# EAGLE design ESP-VINDRIKTNING_no_batt (EAGLE 9.6.2)
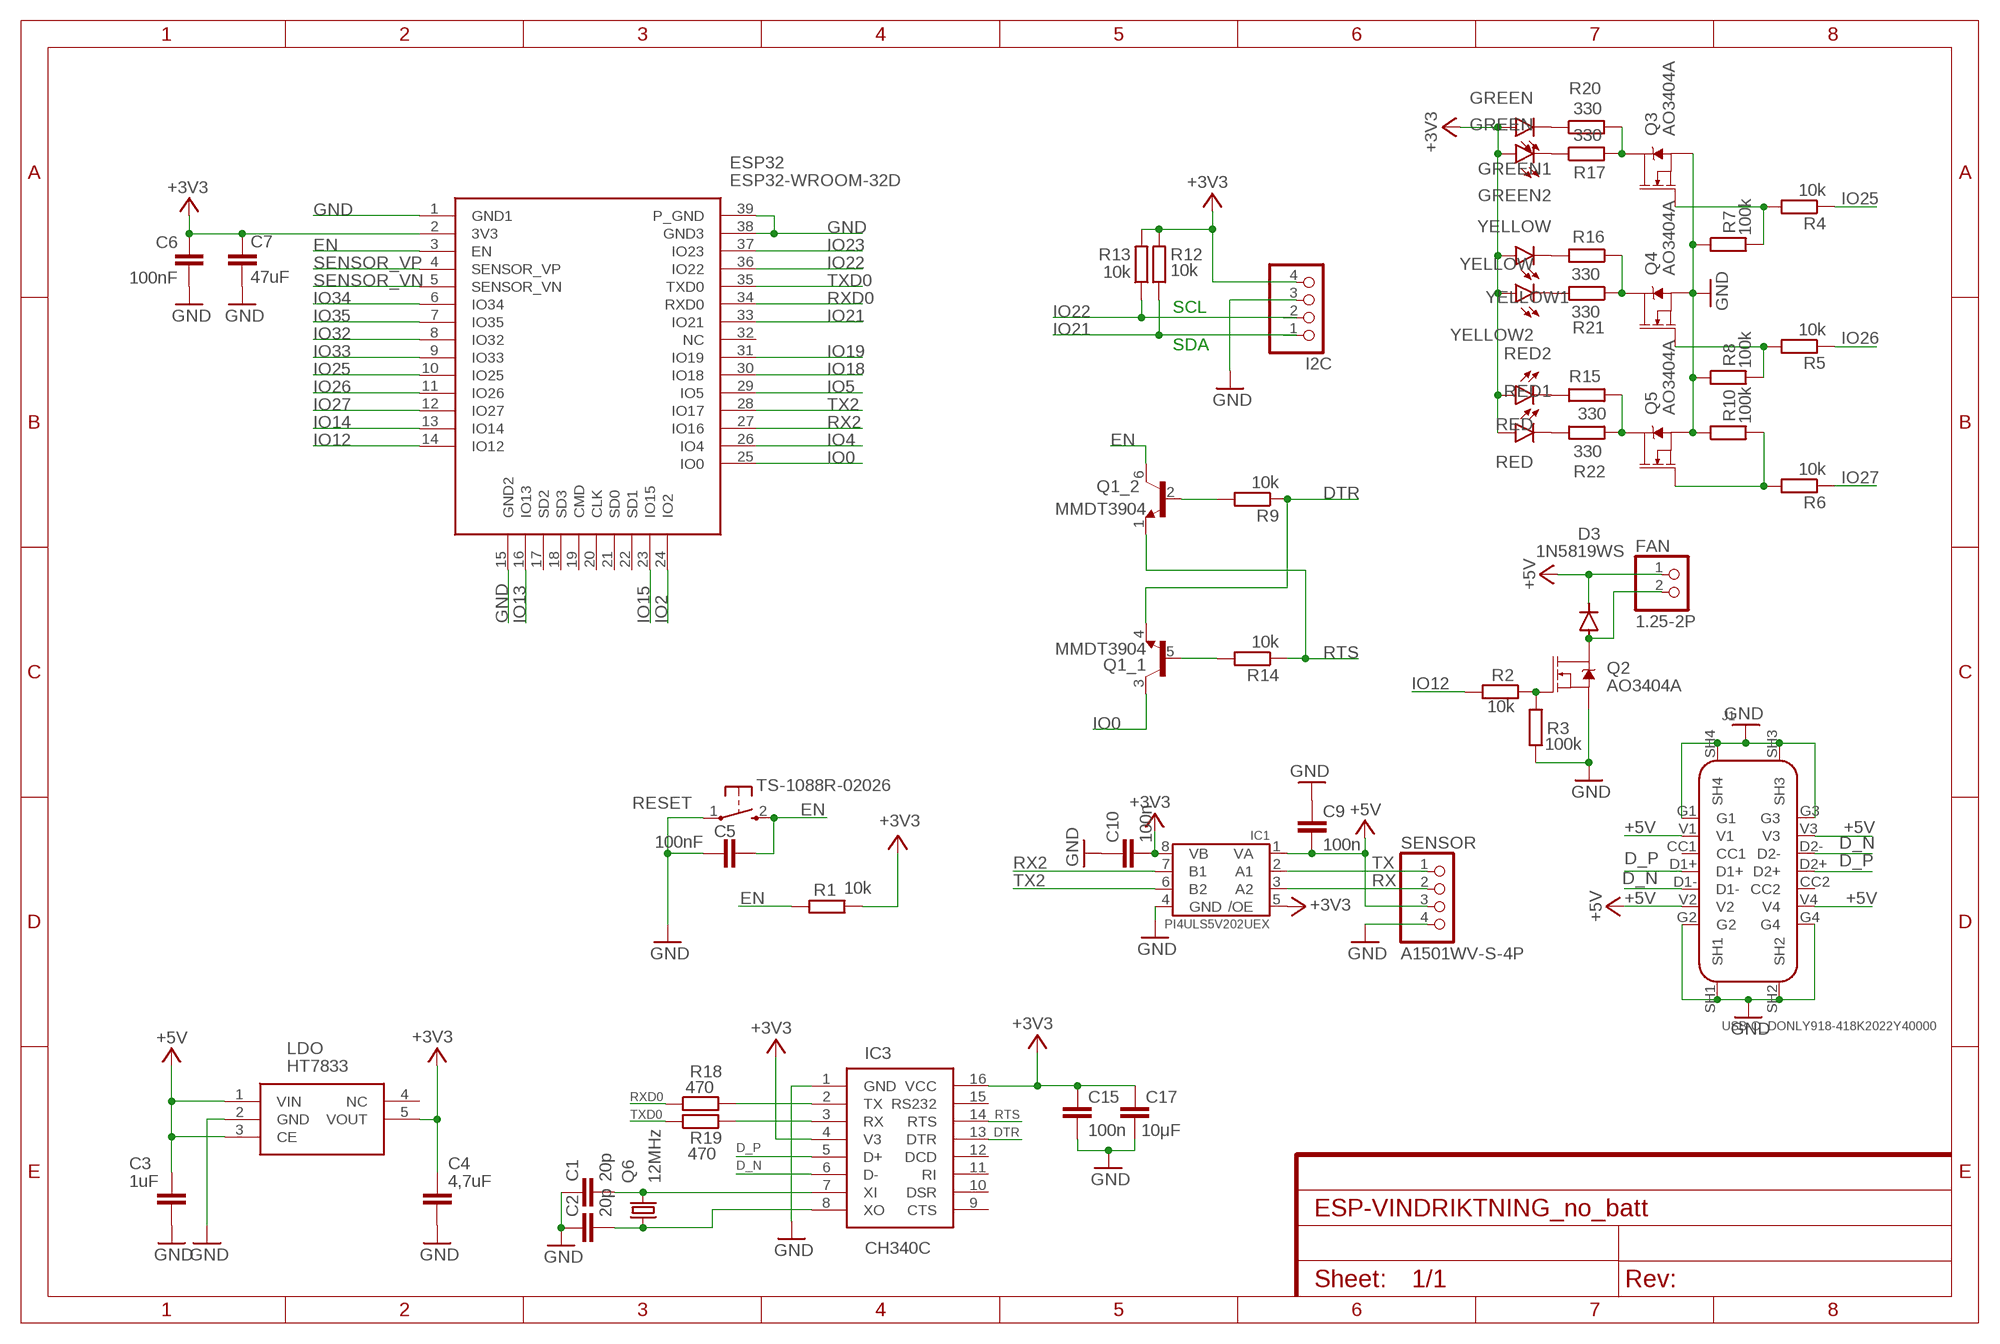
[diagram p0: schematic, sheet 1]

## Parts
C1  20p  C-EUC0402  [C0402]
C2  20p  C-EUC0402  [C0402]
C3  1uF  C-EUC0603  [C0603]
C4  4,7uF  C-EUC0603  [C0603]
C5  100nF  C-EUC0402  [C0402]
C6  100nF  C-EUC0603  [C0603]
C7  47uF  C-EUC0603  [C0603]
C9  100n  C-EUC0603  [C0603]
C10  100n  C-EUC0603  [C0603]
C15  100n  C-EUC0603  [C0603]
C17  10μF  C-EUC0603  [C0603]
D3  1N5819WS  DIODE-SOD323-R  [SOD323-R]
ESP32  ESP32-WROOM-32D  [ESP32WROOM32D]
FAN  1.25-2P  [1.25-2P]
GREEN1  GREEN  LEDCHIP-LED0603  [CHIP-LED0603]
GREEN2  GREEN  LEDCHIP-LED0603  [CHIP-LED0603]
I2C  PINHD-1X4  [1X04]
IC1  PI4ULS5V202UEX  [MSOP8]
IC3  CH340C  USB_UART_CONVERTOR_CH340G  [SOIC16]
J1  USB-C_DONLY918-418K2022Y40000  [USB-C-TH]
LDO  HT7833  HT78XX-SOT23-5SOT23-5  [SOT23-5]
Q1  MMDT3904  TRANS_NPN_DUAL-MBT3904DW1T1  [SC70-6]
Q2  AO3404A  MOSFET-NCH-AO3404A  [SOT23-3]
Q3  AO3404A  MOSFET-NCH-AO3404A  [SOT23-3]
Q4  AO3404A  MOSFET-NCH-AO3404A  [SOT23-3]
Q5  AO3404A  MOSFET-NCH-AO3404A  [SOT23-3]
Q6  12MHz  KX-7  [3.2X2.5_KX-7]
R1  10k  R-EU_R0402  [R0402]
R2  10k  R-EU_R0402  [R0402]
R3  100k  R-EU_R0402  [R0402]
R4  10k  R-EU_R0402  [R0402]
R5  10k  R-EU_R0402  [R0402]
R6  10k  R-EU_R0402  [R0402]
R7  100k  R-EU_R0402  [R0402]
R8  100k  R-EU_R0402  [R0402]
R9  10k  R-EU_R0402  [R0402]
R10  100k  R-EU_R0402  [R0402]
R12  10k  R-EU_R0603  [R0603]
R13  10k  R-EU_R0603  [R0603]
R14  10k  R-EU_R0402  [R0402]
R15  330  R-EU_R0603  [R0603]
R16  330  R-EU_R0603  [R0603]
R17  330  R-EU_R0603  [R0603]
R18  470  R-EU_R0402  [R0402]
R19  470  R-EU_R0402  [R0402]
R20  330  R-EU_R0603  [R0603]
R21  330  R-EU_R0603  [R0603]
R22  330  R-EU_R0603  [R0603]
RED1  RED  LEDCHIP-LED0603  [CHIP-LED0603]
RED2  RED  LEDCHIP-LED0603  [CHIP-LED0603]
RESET  TS-1088R-02026  MOMENTARY_SWITCH_TS-1088R-02026  [TS1088R02026]
SENSOR  A1501WV-S-4P  [A1501WV-S-4P]
YELLOW1  YELLOW  LEDCHIP-LED0603  [CHIP-LED0603]
YELLOW2  YELLOW  LEDCHIP-LED0603  [CHIP-LED0603]

## Nets
+3V3: C4.1 C6.1 C7.1 C10.2 C15.1 C17.1 ESP32.2(3V3) GREEN1.A GREEN2.A I2C.4 IC1.5(/OE) IC1.8(VB) IC3.4(V3) IC3.16(VCC) LDO.5(VOUT) R1.1 R12.2 R13.2 RED1.A RED2.A YELLOW1.A YELLOW2.A
+5V: C3.1 C9.2 D3.C FAN.1 IC1.1(VA) J1.V1 J1.V2 J1.V3 J1.V4 LDO.1(VIN) LDO.3(CE) SENSOR.3
D_N: IC3.6(D-) J1.D1- J1.D2-
D_P: IC3.5(D+) J1.D1+ J1.D2+
DTR: IC3.13(DTR) Q1.4(_1:E) R9.1
EN: C5.2 ESP32.3(EN) Q1.6(_2:C) R1.2 RESET.2
G: Q3.3(D) R17.2 R20.2
GND: C1.1 C2.1 C3.2 C4.2 C5.1 C6.2 C7.2 C9.1 C10.1 C15.2 C17.2 ESP32.1(GND1) ESP32.15(GND2) ESP32.38(GND3) ESP32.39(P_GND) I2C.3 IC1.4(GND) IC3.1(GND) J1.G1 J1.G2 J1.G3 J1.G4 J1.SH1 J1.SH2 J1.SH3 J1.SH4 LDO.2(GND) Q2.2(S) Q3.2(S) Q4.2(S) Q5.2(S) R3.2 R7.1 R8.1 R10.1 RESET.1 SENSOR.4
IO0: ESP32.25(IO0) Q1.3(_1:C)
IO2: ESP32.24(IO2)
IO4: ESP32.26(IO4)
IO5: ESP32.29(IO5)
IO12: ESP32.14(IO12) R2.2
IO13: ESP32.16(IO13)
IO14: ESP32.13(IO14)
IO15: ESP32.23(IO15)
IO18: ESP32.30(IO18)
IO19: ESP32.31(IO19)
IO21: ESP32.33(IO21) I2C.1 R12.1
IO22: ESP32.36(IO22) I2C.2 R13.1
IO23: ESP32.37(IO23)
IO25: ESP32.10(IO25) R4.1
IO26: ESP32.11(IO26) R5.1
IO27: ESP32.12(IO27) R6.1
IO32: ESP32.8(IO32)
IO33: ESP32.9(IO33)
IO34: ESP32.6(IO34)
IO35: ESP32.7(IO35)
N$1: GREEN1.C R20.1
N$2: D3.A FAN.2 Q2.3(D)
N$3: Q2.1(G) R2.1 R3.1
N$4: C1.2 IC3.7(XI) Q6.3
N$8: Q1.5(_1:B) R14.2
N$9: Q5.1(G) R6.2 R10.2
N$10: Q4.1(G) R5.2 R8.2
N$11: R21.2 YELLOW2.C
N$12: Q1.2(_2:B) R9.2
N$13: R15.1 RED2.C
N$14: R16.2 YELLOW1.C
N$15: R22.1 RED1.C
N$16: GREEN2.C R17.1
N$17: Q3.1(G) R4.2 R7.2
N$18: C2.2 IC3.8(XO) Q6.1
N$23: IC3.2(TX) R18.2
N$27: IC3.3(RX) R19.2
R: Q5.3(D) R15.2 R22.2
RTS: IC3.14(RTS) Q1.1(_2:E) R14.1
RX: IC1.3(A2) SENSOR.2
RX2: ESP32.27(IO16) IC1.7(B1)
RXD0: ESP32.34(RXD0) R18.1
SENSOR_VN: ESP32.5(SENSOR_VN)
SENSOR_VP: ESP32.4(SENSOR_VP)
TX: IC1.2(A1) SENSOR.1
TX2: ESP32.28(IO17) IC1.6(B2)
TXD0: ESP32.35(TXD0) R19.1
Y: Q4.3(D) R16.1 R21.1
Unconnected: ESP32.17(SD2) ESP32.18(SD3) ESP32.19(CMD) ESP32.20(CLK) ESP32.21(SD0) ESP32.22(SD1) ESP32.32(NC) IC3.9(CTS) IC3.10(DSR) IC3.11(RI) IC3.12(DCD) IC3.15(RS232) J1.CC1 J1.CC2 LDO.4(NC)

## Notes on the sheet
- SCL
- SDA

## Library data of the parts
C1-C3 C5 C6 C9 C10 C15 C17 = rcl:C-EU: CAPACITOR, European symbol; SPICEPREFIX: C
C4 = rcl:C-EU: CAPACITOR, European symbol; LCSC_PART: C19666; SPICEPREFIX: C
C7 = rcl:C-EU: CAPACITOR, European symbol; LCSC_PART: C122913; SPICEPREFIX: C
D3 = diode:DIODE-: DIODE
ESP32 = LasKKit-Modules:ESP32-WROOM-32D: WiFi Modules (802.11) SMD Module, ESP32-D0WD, 32Mbits SPI flash, UART mode, PCB antenna Source: Datasheet <https://www.mouser.com/datasheet/2/891/esp32-wroom-32d_esp32-wroom-32u_datasheet_en-1365844.pdf>; LCSC_PART: C82899
FAN = LasKKit-Connectors:1.25; LCSC_PART: C393945
GREEN1 GREEN2 RED1 RED2 YELLOW1 YELLOW2 = led:LED: LED OSRAM: - CHIPLED LG R971, LG N971, LY N971, LG Q971, LY Q971, LO R971, LY R971 LH N974, LH R974 LS Q976, LO Q976, LY Q976 LO Q996 - Hyper CHIPLED LW Q18S LB Q993, LB Q99A, LB R99A - SideLED LS A670, LO A670, LY A670, LG A670, LP A670 LB A673, LV A673, LT A673, LW A673 LH A674 LY A675 LS A676, LA A676, LO A676, LY A676, LW A676 LS A679, LY A679, LG A679 - Hyper Micro SIDELED® LS Y876, LA Y876, LO Y876, LY Y876 LT Y87S - SmartLED LW L88C, LW L88S LB L89C, LB L89S, LG L890 LS L89K, LO L89K, LY L89K LS L896, LA L896, LO L896, LY L896 - TOPLED LS T670, LO T670, LY T670, LG T670, LP T670 LSG T670, LSP T670, LSY T670, LOP T670, LYG T670 LG T671, LOG T671, LSG T671 LB T673, LV T673, LT T673, LW T673 LH T674 LS T676, LA T676, LO T676, LY T676, LB T676, LH T676, LSB T676, LW T676 LB T67C, LV T67C, LT T67C, LS T67K, LO T67K, LY T67K, LW E67C LS E67B, LA E67B, LO E67B, LY E67B, LB E67C, LV E67C, LT E67C LW T67C LS T679, LY T679, LG T679 LS T770, LO T770, LY T770, LG T770, LP T770 LB T773, LV T773, LT T773, LW T773 LH T774 LS E675, LA E675, LY E675, LS T675 LS T776, LA T776, LO T776, LY T776, LB T776 LHGB T686 LT T68C, LB T68C - Hyper Mini TOPLED® LB M676 - Mini TOPLED Santana® LG M470 LS M47K, LO M47K, LY M47K Source: http://www.osram.convergy.de LUXEON: - LUMILED® LXK2-PW12-R00, LXK2-PW12-S00, LXK2-PW14-U00, LXK2-PW14-V00 LXK2-PM12-R00, LXK2-PM12-S00, LXK2-PM14-U00 LXK2-PE12-Q00, LXK2-PE12-R00, LXK2-PE12-S00, LXK2-PE14-T00, LXK2-PE14-U00 LXK2-PB12-K00, LXK2-PB12-L00, LXK2-PB12-M00, LXK2-PB14-N00, LXK2-PB14-P00, LXK2-PB14-Q00 LXK2-PR12-L00, LXK2-PR12-M00, LXK2-PR14-Q00, LXK2-PR14-R00 LXK2-PD12-Q00, LXK2-PD12-R00, LXK2-PD12-S00 LXK2-PH12-R00, LXK2-PH12-S00 LXK2-PL12-P00, LXK2-PL12-Q00, LXK2-PL12-R00 Source: www.luxeon.com KINGBRIGHT: KA-3528ASYC Source: www.kingbright.com
I2C = LasKKit-Connectors:PINHD-1X4: PIN HEADER; LCSC_PART: C2321
IC1 = LasKKit-IC:PI4ULS5V202UEX: 2-Bit Bi-directional Level Shifter with Automatic Sensing & Ultra Tiny Package; LCSC_PART: C481697
IC3 = LasKKit-IC:USB_UART_CONVERTOR_CH340G: Single-Chip USB to UART Bridge
J1 = LasKKit-Connectors:USB-C_DONLY; LCSC_PART: C168704
LDO = LasKKit-Power:HT78XX-SOT23-5: Low Dropout Regulators(LDO) SOT-23-5 RoHS Source: Datasheet <https://datasheet.lcsc.com/szlcsc/1809291540_Holtek-Semicon-HT7833_C164106.pdf>
Q1 = LasKKit-Discrete:TRANS_NPN_DUAL: Dual NPN Transistors in Single Package The MBT3904W1 puts two general purpose 3904 NPN transistors in a single package. Datasheet <http://www.onsemi.com/pub_link/Collateral/MBT3904DW1T1-D.PDF> SparkFun Products: SparkFun ESP32 Thing <https://www.sparkfun.com/products/13907>; LCSC_PART: C268586; PROD_ID: TRANS-13337
Q2-Q5 = SparkFun-DiscreteSemi:MOSFET-NCH: N-channel MOSFETs Voltage controlled devices that allow control of high current outputs. SparkFun Products: SparkFun OpenScale <https://www.sparkfun.com/products/13261> SparkFun Digital Sandbox <https://www.sparkfun.com/products/12651> SparkFun Monster Moto Shield <https://www.sparkfun.com/products/10182> SparkFun MOSFET Power Controller <https://www.sparkfun.com/products/11214>; PROD_ID: TRANS-12988; VALUE: 5.8A/30V/35mΩ
Q6 = crystal-geyer_V1_0:KX: Quartz Crystals (MHz) SMD: KX - Serie Model Size l/w/h [mm] Frequency Range Frequency Stability Temp. Range [°C] Load Capacitance AECQ 200 availabel Datasheet KX-4 KX-5 KX-6 KX-7 KX-9A KX-9B KX-12A KX-12B KX-13 KX-20 KX-K KX-KS 1.6/1.2/0.3 2.0/1.6/0.45 2.5/2.0/0.55 3.2/2.5/0.8 5.0/3.2/1.0 5.0/3.2/1.1 6.0/3.5/1.1 6.0/3.5/1.0 7.0/5.0 /1.3 11.6/5.5/1.6 12.3/4.5/4.2 12.3/4.5/3.2 24.0 ~ 80.0 MHz 16.0 ~ 80.0 MHz 12.0 ~ 80.0 MHz 8.0 ~ 60.0 MHz 7,68 ~ 300,0 MHz 8,0 ~ 50,0 MHz 8,0 ~ 150,0 MHz 8,0 ~ 50,0 MHz 6,0 ~ 160,0 MHz 3,579 ~ 25,0 MHz 3,579 ~ 70,0 MHz 3,579 ~ 70,0 MHz ±10 … ±50ppm ±10 … ±50ppm ±10 … ±50ppm ±10 … ±50ppm ±10 … ±50ppm ±10 … ±50ppm ±10 … ±50ppm ±10 … ±50ppm ±10 … ±50ppm ±50ppm ±10 … ±50ppm ±10 … ±50ppm (*) -40°C …+85°C (*) -40°C …+125°C (*) -40°C …+125°C (*) -40°C …+125°C (*) -40°C …+105°C (*) -40°C …+105°C (*) -40°C …+125°C (*) -40°C …+105°C (*) -40°C …+105°C (*) -40°C …+105°C (*) -40°C …+85°C (*) -40°C …+85°C 8, 8…16 8, 8…16 10, 8…16 12, 7…20 16, 10…20 16, 10…20 16, 10…20 16, 12…20 16, 12…20 16, 12…20 16, 12…30 16, 12…30 - yes yes yes - - - - - - - - KX-4.pdf <http://www.geyer-electronic.de/uploads/tx_userartikelfrequenz/GEYER-KX-4.pdf> KX-5.pdf <http://www.geyer-electronic.de/uploads/tx_userartikelfrequenz/GEYER-KX-5.pdf> KX-6.pdf <http://www.geyer-electronic.de/uploads/tx_userartikelfrequenz/GEYER-KX-6.pdf> KX-7.pdf <http://www.geyer-electronic.de/uploads/tx_userartikelfrequenz/GEYER-KX-7.pdf> KX-9A.pdf <http://www.geyer-electronic.de/uploads/tx_userartikelfrequenz/GEYER-KX-9A.pdf> KX-9B.pdf <http://www.geyer-electronic.de/uploads/tx_userartikelfrequenz/GEYER-KX-9B.pdf> KX-12A.pdf <http://www.geyer-electronic.de/uploads/tx_userartikelfrequenz/GEYER-KX-12A.pdf> KX-12B.pdf <http://www.geyer-electronic.de/uploads/tx_userartikelfrequenz/GEYER-KX-12B.pdf> KX-13.pdf <http://www.geyer-electronic.de/uploads/tx_userartikelfrequenz/GEYER-KX-13.pdf> KX-20.pdf <http://www.geyer-electronic.de/uploads/tx_userartikelfrequenz/GEYER-KX-20.pdf> KX-K.pdf <http://www.geyer-electronic.de/uploads/tx_userartikelfrequenz/GEYER-KX-K.pdf> KX-KS.pdf <http://www.geyer-electronic.de/uploads/tx_userartikelfrequenz/GEYER-KX-KS.pdf> <http://www.geyer-electronic.de/fileadmin/template/img/logo-geyer-electronic.png> Details see: http://www.geyer-electronic.de/Frequenz-Produkte.9.0.html Created 2016-06-07, Hans Locher 2016 (C) Geyer Quartz Technology KX4,KX5,KX6,KX7,KX9A,KX9B,KX12A,KX12B,KX13,KX20,KXK,KXKS;1612;2016;2520;3225;5032;6035;7050;11655;12345;1,6x1,2;2,0x1,6;2,5x2,0;3,2x2,5;5,0x3,2;6,0x3,5;7,0x5,0;11,6x5,5;12,3x4,5;12,3x4,5;1.6x1.2;2.0x1.6;2.5x2.0;3.2x2.5;5.0x3.2;6.0x3.5;7.0x5.0;11.6x5.5;12.3x4.5;12.3x4.5;; LCSC_PART: C97242
R1-R10 R12-R22 = rcl:R-EU_: RESISTOR, European symbol; SPICEPREFIX: R
RESET = LasKKit-Switch:MOMENTARY_SWITCH_TS-1088R-02026: SMD,3x4x2.0mm Tactile Switches Source: Datasheet <https://datasheet.lcsc.com/szlcsc/1912111437_XUNPU-TS-1088R-02026_C455280.pdf>; DESCRIPTION: SMD,3x4x2.0mm Tactile Switches; HEIGHT: 2.2mm; MANUFACTURER_NAME: XUNPU; MANUFACTURER_PART_NUMBER: TS-1088R-02026
SENSOR = LasKKit-Connectors:A1501WV-S; LCSC_PART: C225162

## Board
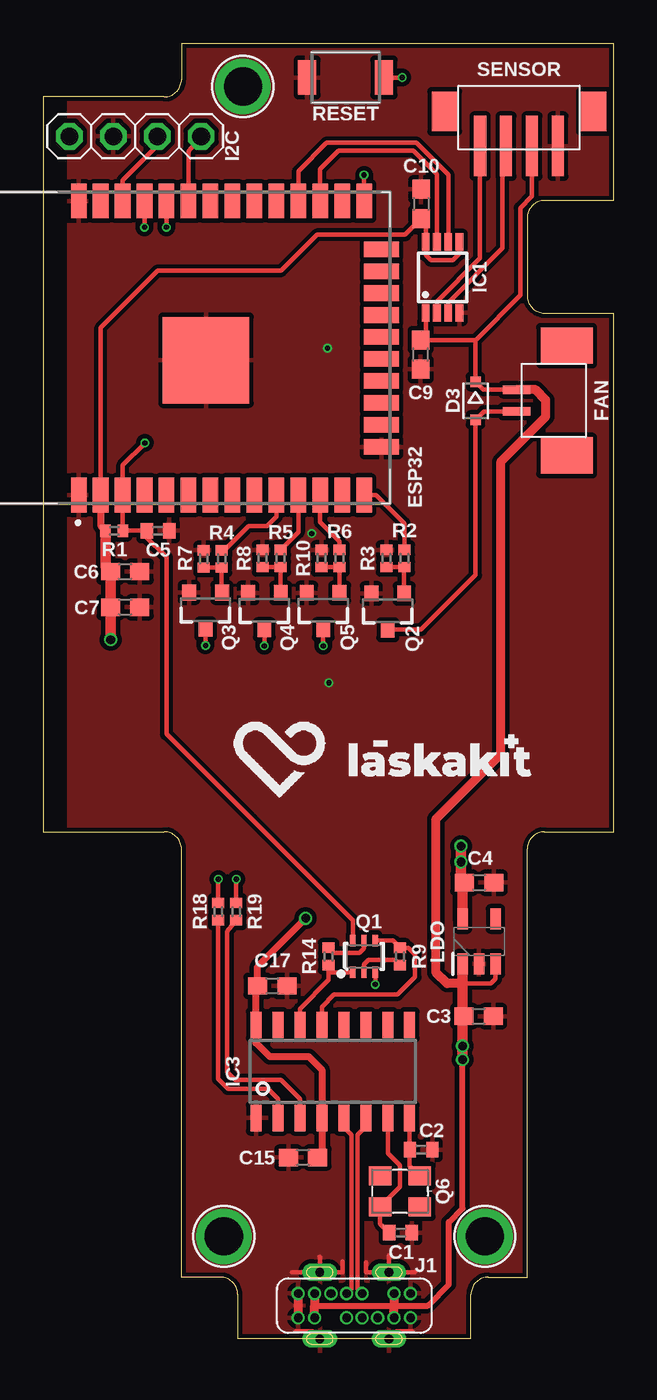
[diagram p1: board, top side]
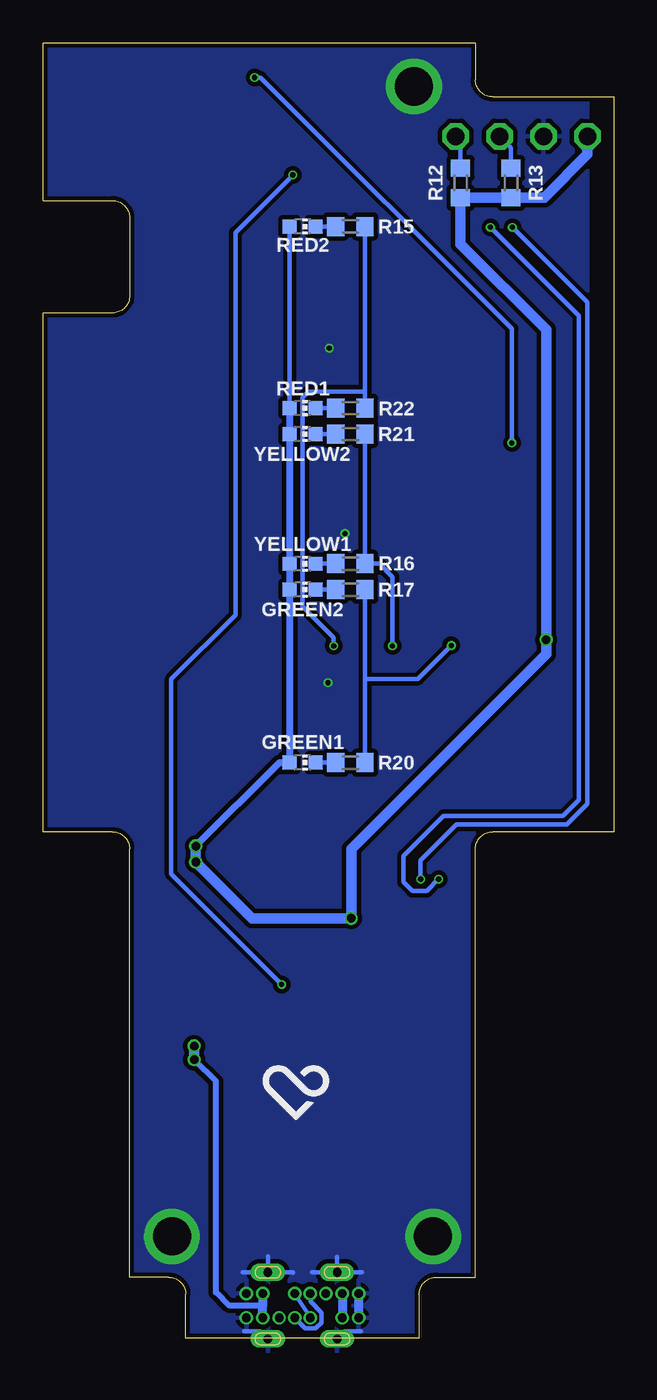
[diagram p2: board, bottom side, seen from below]

Size 33 x 74.9 mm. Coordinates in mm from the lower left corner, seen from the top.
Outline: 11.25,0 24.75,0 24.75,2.55 arc-90 25.75,3.55 28,3.55 28,28.3 arc-90 29,29.3 33,29.3 33,59.3 29,59.3 arc-90 28,60.3 28,64.8 arc-90 29,65.8 33,65.8 33,74.9 8,74.9 8,72.8 arc-90 7,71.8 0,71.8 0,29.3 7,29.3 arc-90 8,28.3 8,3.55 10.25,3.55 arc-90 11.25,2.55 11.25,0
Copper layers (1*16): Top 0.035mm / dielectric 1.5mm / Bottom 0.035mm
Design rules "default *": minimum track width 6mil, minimum drill 0.2mm, track to track 4mil, track to pad 4mil, pad to pad 4mil, via to via 4mil, smd to smd 4mil, copper to edge 0.2mm, drill to drill 6mil, minimum pad ring 4mil, minimum via ring 4mil, stop-mask expansion 4mil, vias tented up to drill 25mil, thermal gap 10mil

### Footprints (pad centres in the part's own frame; a part is rotated, then mirrored left to right if it is on the bottom)
C0402 = smd 0.7 x 0.9: 1 -0.65,0; 2 0.65,0
C0603 = smd 1.1 x 1: 1 -0.85,0; 2 0.85,0
SOD323-R = smd 0.6 x 0.6: A 1.1,0; C -1.1,0
ESP32WROOM32D = smd 0.9 x 2: 1 -5.26,-8.5; 2 -3.99,-8.5; 3 -2.72,-8.5; 4 -1.45,-8.5; 5 -0.18,-8.5; 6 1.09,-8.5; 7 2.36,-8.5; 8 3.63,-8.5; 9 4.9,-8.5; 10 6.17,-8.5; 11 7.44,-8.5; 12 8.71,-8.5; 13 9.98,-8.5; 14 11.25,-8.5; 25 11.25,8.5; 26 9.98,8.5; 27 8.71,8.5; 28 7.44,8.5; 29 6.17,8.5; 30 4.9,8.5; 31 3.63,8.5; 32 2.36,8.5; 33 1.09,8.5; 34 -0.18,8.5; 35 -1.45,8.5; 36 -2.72,8.5; 37 -3.99,8.5; 38 -5.26,8.5 | smd 2 x 0.9: 15 12.25,-5.715; 16 12.25,-4.445; 17 12.25,-3.175; 18 12.25,-1.905; 19 12.25,-0.635; 20 12.25,0.635; 21 12.25,1.905; 22 12.25,3.175; 23 12.25,4.445; 24 12.25,5.715 | smd 5 x 5: 39 2.1,-0.7
1.25-2P = smd 0.5 x 1.6: 1 -0.625,0; 2 0.625,0 | smd 2.1 x 3: P$3 -3.175,2.9; P$4 3.175,2.9
CHIP-LED0603 = smd 0.8 x 0.8: A 0,-0.75; C 0,0.75
1X04 = drill 1.016 octagon: 1 -3.81,0; 2 -1.27,0; 3 1.27,0; 4 3.81,0
MSOP8 = smd 0.45 x 1: 1 -0.975,-2.05; 2 -0.325,-2.05; 3 0.325,-2.05; 4 0.975,-2.05; 5 0.975,2.05; 6 0.325,2.05; 7 -0.325,2.05; 8 -0.975,2.05
SOIC16 = smd 0.635 x 1.524: 1 -4.445,-2.695; 2 -3.175,-2.695; 3 -1.905,-2.695; 4 -0.635,-2.695; 5 0.635,-2.695; 6 1.905,-2.695; 7 3.175,-2.695; 8 4.445,-2.695; 9 4.445,2.695; 10 3.175,2.695; 11 1.905,2.695; 12 0.635,2.695; 13 -0.635,2.695; 14 -1.905,2.695; 15 -3.175,2.695; 16 -4.445,2.695
USB-C-TH = drill 0.5 pad 0.76: CC1 -1.35,0.7; CC2 1.35,-0.7; D1+ -0.45,0.7; D1- 0.45,0.7; D2+ 0.45,-0.7; D2- -0.45,-0.7; G1 -3.25,0.7; G2 3.25,0.7; G3 -3.25,-0.7; G4 3.25,-0.7; V1 -2.3,0.7; V2 2.3,0.7; V3 -2.3,-0.7; V4 2.3,-0.7 | drill 0.5 pad 1 long: SH1 -2,-1.93; SH2 2,-1.93; SH3 -2,1.93; SH4 2,1.93
SOT23-5 = smd 1.2 x 0.6: 1 -1.3,0.95; 2 -1.3,0; 3 -1.3,-0.95; 4 1.3,-0.95; 5 1.3,0.95
SC70-6 = smd 0.3 x 0.66: 1 -0.65,-0.92; 2 0,-0.92; 3 0.65,-0.92; 4 0.65,0.92; 5 0,0.92; 6 -0.65,0.92
SOT23-3 = smd 0.8 x 0.9: 1 -0.95,-1; 2 0.95,-1; 3 0,1.1
3.2X2.5_KX-7 = smd 1.3 x 1.1: 1 -1.15,-0.9; 2 1.15,-0.9; 3 1.15,0.9; 4 -1.15,0.9
R0402 = smd 0.6 x 0.7: 1 -0.5,0; 2 0.5,0
R0603 = smd 1 x 1.1: 1 -0.85,0; 2 0.85,0
TS1088R02026 = smd 1.05 x 2: 1 -2.225,0; 2 2.225,0
A1501WV-S-4P = smd 0.7 x 3.5: 1 -2.25,0; 2 -0.75,0; 3 0.75,0; 4 2.25,0 | smd 1.5 x 2.3: P$5 -4.3,2; P$6 4.3,2

### Placement (x,y rotation side)
C1  20.67,6.12 180 top
C2  21.86,10.92 180 top
C3  25.19,18.64 0 top
C4  25.21,26.36 0 top
C5  6.65,46.71 180 top
C6  4.74,44.34 0 top
C7  4.74,42.29 0 top
C9  21.84,56.89 90 top
C10  21.86,65.6 270 top
C15  15.03,10.46 180 top
C17  13.25,20.39 0 top
D3  25.01,54.22 270 top
ESP32  7.32,57.27 0 top
FAN  27.39,54.24 270 top
GREEN1  18,33.3 270 bottom
GREEN2  18,43.3 270 bottom
I2C  5.33,69.52 180 top
IC1  23.11,61.36 0 top
IC3  16.76,15.44 0 top
J1  18,1.9 0 top
LDO  25.21,22.96 90 top
Q1  18.56,22.09 0 top
Q2  19.93,42.08 180 top
Q3  9.39,42.13 180 top
Q4  12.79,42.11 180 top
Q5  16.2,42.11 180 top
Q6  20.64,8.5 180 top
R1  4.11,46.71 0 top
R2  20.9,45.11 90 top
R3  19.85,45.11 90 top
R4  10.33,45.08 270 top
R5  13.73,45.11 270 top
R6  17.14,45.11 270 top
R7  9.29,45.08 270 top
R8  12.69,45.11 270 top
R9  20.64,22.09 270 top
R10  16.09,45.11 270 top
R12  8.86,66.82 270 bottom
R13  5.94,66.82 270 bottom
R14  16.5,22.09 90 top
R15  15.23,64.3 0 bottom
R16  15.23,44.8 180 bottom
R17  15.23,43.3 0 bottom
R18  10.13,24.68 270 top
R19  11.17,24.68 270 top
R20  15.23,33.3 0 bottom
R21  15.23,52.3 180 bottom
R22  15.23,53.8 0 bottom
RED1  18,53.8 270 bottom
RED2  18,64.3 270 bottom
RESET  17.49,72.92 0 top
SENSOR  27.52,68.96 0 top
U$1  [LASKKIT_20MM_SILKSCREEN]  19.83,33.4 0 top
U$2  [LASKAKIT_HEART_4MM]  18.38,14.22 0 bottom
YELLOW1  18,44.8 270 bottom
YELLOW2  18,52.3 270 bottom

### Tracks (layer width: path | path; a pad name or v marks a point on that pad's centre or on a via)
+3V3  (via drill 0.5)
  Top 0.254: IC1.5 24.08,62.72 23.71,62.35 22.42,62.35 22.13,62.64 IC1.8 22.13,64.48 C10.2 20.93,63.82 15.84,63.82 13.76,61.74 6.62,61.74 3.33,58.45 3.33,49.73 3.32,49.73 3.24,49.64 3.24,49.61 3.22,49.59 3.24,49.47 3.24,49.32 3.33,49.24 ESP32.2
  Top 0.406: C15.1 16.12,10.7 IC3.4 16.12,15.54 15.36,16.3 13.1,16.3 12.31,17.09 IC3.16 12.31,20.3 C17.1 12.4,21.51 v15.18,24.29 v15.18,24.3 | ESP32.2 3.33,46.99 R1.1
  Top 0.61: LDO.5 24.26,26.26 C4.1 24.16,26.56 v24.16,27.54 v24.17,27.55 v24.17,28.47 | v3.9,40.41 3.9,42.27 C7.1 C6.1 3.61,44.63 R1.1
  Bottom 0.254: RED2.A RED1.A
  Bottom 0.406: RED1.A YELLOW2.A YELLOW1.A GREEN2.A GREEN1.A 19.34,33.3 v24.17,28.47
  Bottom 0.61: v24.17,28.47 v24.17,27.55 20.92,24.3 v15.18,24.3 15.18,28.32 3.9,39.59 v3.9,40.41 3.9,58.34 8.86,63.29 R12.2 R13.2 4.02,65.97 1.52,68.47 I2C.4
+5V  (via drill 0.5)
  Top 0.254: IC1.1 22.13,58.04 C9.2 25.02,57.74 | FAN.1 25.47,54.86 D3.C 25.01,57.73 25.02,57.74 | LDO.3 26.16,20.78 25.9,20.52 24.26,20.52 | SENSOR.3 28.27,66.05 27.6,65.38 27.6,60.32 25.02,57.74
  Top 0.356: 15.7,1.9 20.31,1.9 22.24,1.9 23.46,3.12 23.46,6.72 24.26,7.52 v24.26,16.12
  Top 0.508: J1.V1 15.7,1.9 J1.V3 | J1.V4 20.3,1.89 20.31,1.9 20.3,1.91 J1.V2 | 24.26,20.52 23.36,20.52 22.72,21.15 22.72,30.04 26.48,33.8 26.48,50.72 29.07,53.31 29.07,54.27 28.49,54.86 FAN.1
  Top 0.61: LDO.1 24.26,20.52 24.26,18.64 | 24.26,18.64 C3.1 | v24.26,16.12 v24.26,16.91 24.26,18.64
  Bottom 0.356: 20.3,1.9 22.24,1.9 23,2.66 23,14.88 v24.26,16.12
  Bottom 0.508: J1.V1 J1.V3 | J1.V2 20.3,1.9 J1.V4
  Bottom 0.61: v24.26,16.91 v24.26,16.12
D_N
  Top 0.254: J1.D1- 18.18,2.87 18.18,11.78 18.64,12.24 18.64,12.72 IC3.6
  Bottom 0.254: J1.D2- J1.D1-
D_P
  Top 0.254: J1.D1+ 17.82,2.87 17.82,11.78 17.36,12.24 17.36,12.72 IC3.5
  Bottom 0.254: J1.D1+ 17.55,2.14 16.91,1.49 16.91,0.91 17.24,0.58 17.85,0.58 18.45,1.18 J1.D2+
DTR
  Top 0.254: Q1.4 20.22,23.01 R9.1 21.13,22.59 21.5,22.22 21.5,20.9 20.49,19.88 16.83,19.88 16.12,19.17 IC3.13
EN  (via drill 0.3)
  Top 0.254: R1.2 4.74,46.71 | 4.74,46.71 C5.2 5.88,46.59 5.88,46.43 7.13,45.18 7.13,34.95 17.91,24.17 Q1.6 | 4.74,46.71 4.74,46.7 4.6,46.77 ESP32.3 4.6,50.5 v5.88,51.79 | v20.77,72.92 RESET.2
  Bottom 0.254: v5.88,51.79 5.88,58.39 20.41,72.92 v20.77,72.92
G  (via drill 0.3)
  Top 0.254: Q3.3 v9.39,40.08
  Bottom 0.254: 14.38,38.15 R20.2 | R17.2 14.38,38.15 | 14.38,38.15 11.32,38.15 v9.39,40.08
GND  (via drill 0.3, 2.2 pad 3.2)
  Top 0.254: J1.SH3 17.31,3.83 17.31,4.47 | J1.SH3 16,4.72 15.99,4.72 | J1.SH4 20,4.8 20.01,4.8 | J1.SH4 18.69,3.83 18.69,4.42 | J1.SH4 21.5,3.83 21.5,3.86 | J1.SH3 14.39,3.83 | J1.SH1 15.57,0.4 14.6,0.4 | J1.SH2 20.43,0.4 21.35,0.4
  Top 0.508: J1.G1 J1.G3
  Bottom 0.254: 19.98,4.75 20,4.75 J1.SH4 18.56,3.83 18.56,3.8 | J1.SH3 17.44,3.83 | J1.SH3 16,4.72 15.99,4.72 | J1.SH3 14.57,3.83 | J1.SH4 21.45,3.83 | J1.SH2 20.43,0.4 21.38,0.4 | J1.SH1 15.57,0.4 14.62,0.4
  Bottom 0.508: J1.G1 J1.G3
  other vias: 11.55,72.4 25.55,5.9 10.45,5.9 15.54,46.55 16.45,57.27 16.53,37.92
  pour Top (isolate 0.254): 8,-0.7 8,29.3 1.51,29.3 1.51,74.9 33,74.9 33,29.3 28,29.3 28.09,-0.7
  pour Bottom (isolate 0.254): 8,-0.7 8,29.3 1.51,29.3 1.51,74.9 33,74.9 33,29.3 28,29.3 28,-0.7
IO0  (via drill 0.3)
  Top 0.254: Q1.3 v19.21,20.47 | ESP32.25 v18.57,67.27 v18.56,67.28
  Bottom 0.254: v19.21,20.47 25.59,26.86 25.59,38.12 21.89,41.83 21.89,63.95 v18.56,67.28
IO12
  Top 0.254: ESP32.14 19.26,48.77 20.9,47.14 R2.2
IO21
  Top 0.254: I2C.1 8.41,68.66 ESP32.33
  Bottom 0.254: R12.1 8.86,69.24 I2C.1
IO22
  Top 0.254: ESP32.36 4.6,66.97 6.6,68.97 I2C.2
  Bottom 0.254: R13.1 5.94,68.86 I2C.2
IO25
  Top 0.254: R4.1 10.48,45.58 11.88,46.98 12.94,46.98 13.49,47.53 ESP32.10
IO26
  Top 0.254: ESP32.11 14.76,46.63 R5.1
IO27
  Top 0.254: R6.1 17.14,46.1 16.03,47.21 ESP32.12
N$1
  Bottom 0.254: R20.1 GREEN1.C
N$2
  Top 0.254: FAN.2 25.5,53.61 D3.A 25.01,44.14 21.85,40.98 Q2.3
N$3
  Top 0.254: Q2.1 20.88,44.59 | 20.88,44.59 R2.1 | R3.1 20.87,44.61 20.88,44.59
N$4
  Top 0.254: IC3.7 19.93,10.71 20.64,10 20.64,8.75 Q6.3 19.49,6.64 C1.2
N$8
  Top 0.254: Q1.5 18.56,22.55 18.3,22.3 16.8,22.3 R14.2
N$9
  Top 0.254: R10.2 R6.2 17.15,44.59 Q5.1
N$10
  Top 0.254: R8.2 R5.2 13.74,44.59 Q4.1
N$11
  Bottom 0.254: R21.2 YELLOW2.C
N$12
  Top 0.254: Q1.2 18.56,21.64 18.81,21.89 20.34,21.89 R9.2
N$13
  Bottom 0.254: R15.1 RED2.C
N$14
  Bottom 0.254: R16.2 YELLOW1.C
N$15
  Bottom 0.254: R22.1 RED1.C
N$16
  Bottom 0.254: R17.1 GREEN2.C
N$17
  Top 0.254: R7.2 R4.2 10.33,43.14 Q3.1
N$18
  Top 0.254: IC3.8 C2.2 | C2.2 21.2,10 Q6.1 | C2.2
N$23
  Top 0.254: IC3.2 13.58,13.86 13,14.45 10.68,14.45 10.13,15.01 R18.2
N$27
  Top 0.254: IC3.3 14.85,13.86 13.76,14.96 11.09,14.96 10.63,15.41 10.63,23.53 R19.2
R  (via drill 0.3)
  Top 0.254: Q5.3 v16.2,40.05
  Bottom 0.254: R22.2 14.38,54.76 | 14.38,54.76 17.64,54.76 18,54.4 18,42.34 16.2,40.53 v16.2,40.05 | R15.2 14.38,54.76
RTS
  Top 0.254: Q1.1 16.51,21.17 16.5,21.18 | IC3.14 14.85,19.07 16.5,20.72 16.5,21.18 | 16.5,21.18 R14.1
RX
  Top 0.254: IC1.3 23.43,59.91 26.57,63.05 26.57,68.75 SENSOR.2
RX2
  Top 0.254: ESP32.27 16.03,67.62 17.09,68.68 21.43,68.68 22.78,67.33 IC1.7
RXD0  (via drill 0.3)
  Top 0.254: R18.1 v10.13,26.56 | ESP32.34 v7.14,64.26 v7.13,64.26
  Bottom 0.254: v7.13,64.26 2.02,59.15 2.02,31.14 2.94,30.22 9.85,30.22 12.16,27.91 12.16,26.39 11.65,25.88 10.81,25.88 v10.13,26.56
TX
  Top 0.254: IC1.2 22.78,59.97 25.27,62.46 SENSOR.1
TX2
  Top 0.254: ESP32.28 14.76,67.49 16.4,69.13 21.58,69.13 23.43,67.28 IC1.6
TXD0  (via drill 0.3)
  Top 0.254: v11.17,26.56 R19.1 | ESP32.35 v5.87,64.26 v5.86,64.26
  Bottom 0.254: v11.17,26.56 11.17,27.63 9.09,29.71 2.71,29.71 1.52,30.91 1.52,59.91 v5.86,64.26
Y  (via drill 0.3)
  Top 0.254: Q4.3 v12.79,40.05
  Bottom 0.254: R21.1 R16.1 13.55,44.8 12.79,44.04 v12.79,40.05